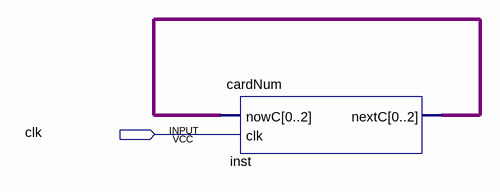
[diagram p0: schematic sheet]
// Quartus schematic Block1.bdf as structural Verilog: 1 symbols, 1 pins
module Block1 (
  input  clk
);

  wire [2:0] inst_nextc;

  cardNum inst (.nowC(inst_nextc), .clk(clk), .nextC(inst_nextc));
endmodule
